# Altium schematic sheet Power Regulators.SchDoc
size A4; SheetNumber: 1; SheetTotal: 4
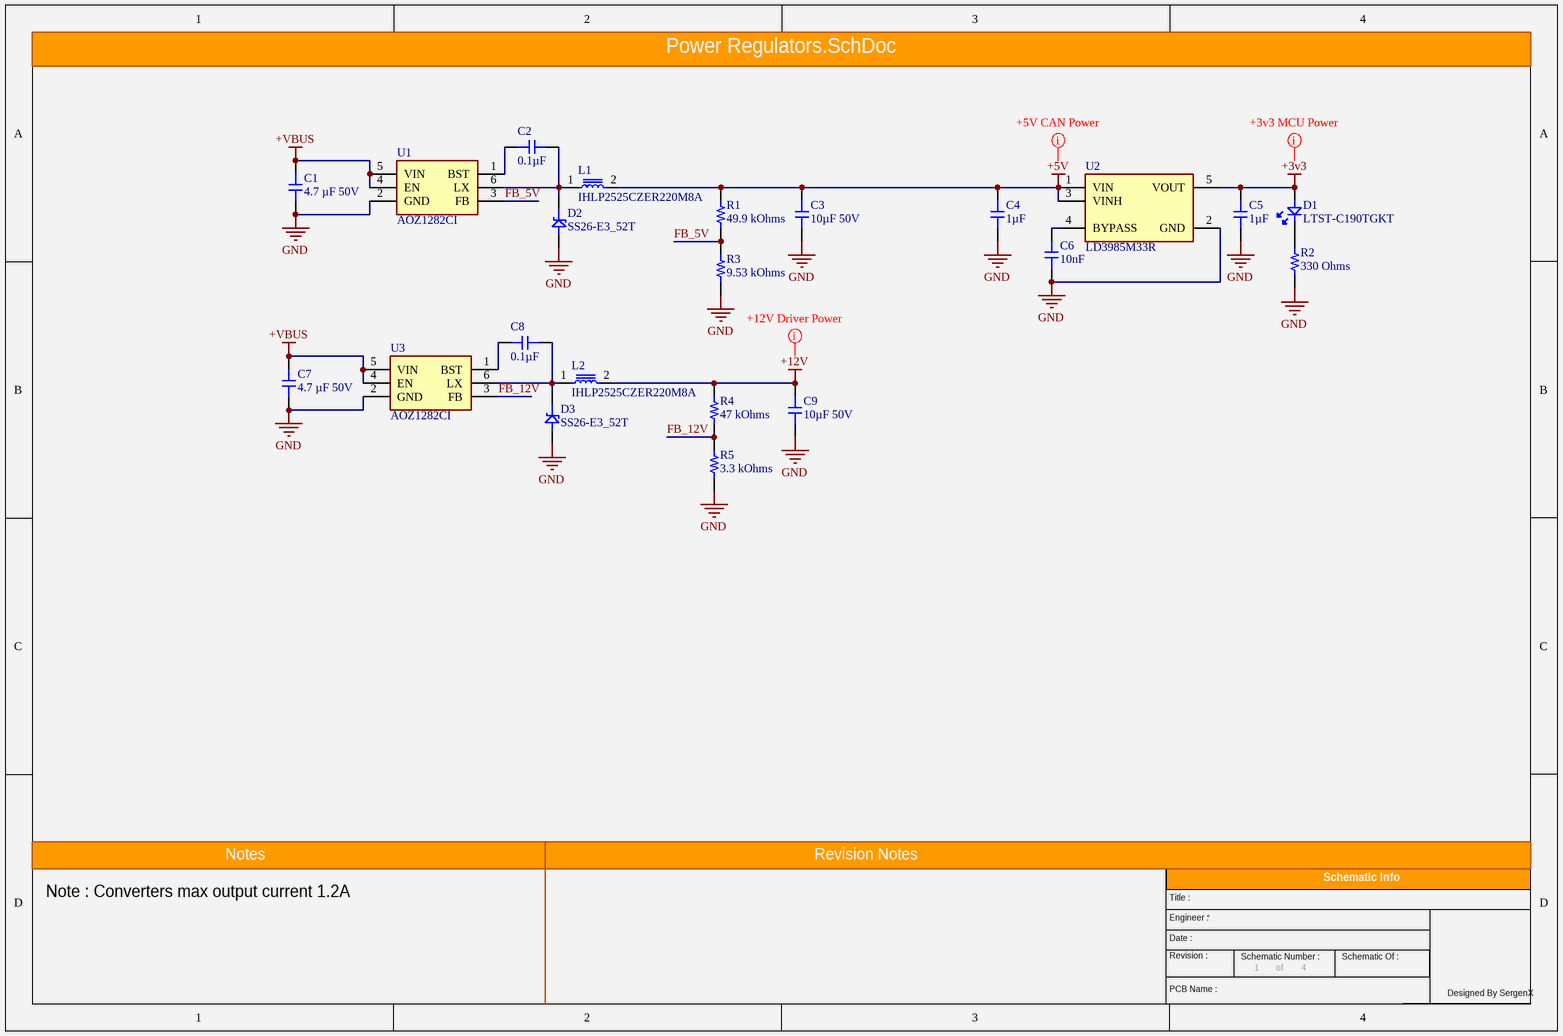
[diagram p0: Power Regulators.SchDoc]

## Parts
C1  4.7 µF 50V  [1206_10uF]
C2  0.1µF  [0805]
C3  10µF 50V  [1206_10uF]
C4  1µF  [0603_Footprint]
C5  1µF  [0603_Footprint]
C6  10nF  [0603_Footprint]
C7  4.7 µF 50V  [1206_10uF]
C8  0.1µF  [0805]
C9  10µF 50V  [1206_10uF]
D1  LTST-C190TGKT  [LEDC1608X80N]
D2  SS26-E3_52T  [DIOM5436X244N]
D3  SS26-E3_52T  [DIOM5436X244N]
L1  IHLP2525CZER220M8A  [INDPM6965X300N]
L2  IHLP2525CZER220M8A  [INDPM6965X300N]
R1  49.9 kOhms  [0603_RES]
R2  330 Ohms  [0603_RES]
R3  9.53 kOhms  [0603_RES]
R4  47 kOhms  [0603_RES]
R5  3.3 kOhms  [0603_RES]
U1  AOZ1282CI  [SOT95P280X125-6N]
U2  LD3985M33R  [SOT95P280X145-5N]
U3  AOZ1282CI  [SOT95P280X125-6N]

## Nets
+3v3: C5.1 D1.2(A) U2.5(VOUT)
+5V: C3.1 C4.1 L1.2 R1.2 U2.1(VIN) U2.3(VINH)
+12V: C9.1 L2.2 R4.2
+VBUS: C1.1 C7.1 U1.4(EN) U1.5(VIN) U3.4(EN) U3.5(VIN)
GND: C1.2 C3.2 C4.2 C5.2 C6.2 C7.2 C9.2 D2.2(A) D3.2(A) R2.1 R3.1 R5.1 U1.2(GND) U2.2(GND) U3.2(GND)
FB_5V: R1.1 R3.2 U1.3(FB)
FB_12V: R4.1 R5.2 U3.3(FB)
NetC2_1: C2.1 U1.1(BST)
NetC2_2: C2.2 D2.1(K) L1.1 U1.6(LX)
NetC6_1: C6.1 U2.4(BYPASS)
NetC8_1: C8.1 U3.1(BST)
NetC8_2: C8.2 D3.1(K) L2.1 U3.6(LX)
NetD1_1: D1.1(K) R2.2

## Layout directives
mark named +12V Driver Power: (no net found under the mark)
mark named +5V CAN Power: (no net found under the mark)
mark named +3v3 MCU Power: (no net found under the mark)

## Notes on the sheet
- Note : Converters max output current 1.2A
- Notes
- Revision Notes
- Title :
- Engineer :
- Schematic Info
- Date :
- Revision :
- PCB Name :
- Schematic Number :
- of
- Schematic Of :
- Designed By SergenX

## Library data of the parts
C1 C7 = 4.7 uF 50V 1206: 10 uF 50V 1206
C2 C8 = 0.1uF 0805 Surface Capacitor
C3 C9 = 10 uF 50V 1206
C4 C5 = 1uF 0603 Surface Capacitor
C6 = 10nF 0603 Surface Capacitor
D1 = LTST-C190TGKT: 20mA Generic 0603 Led SMD; Manufacturer_Name: Lite-On; Manufacturer_Part_Number: LTST-C190KRKT; Datasheet Link: https://componentsearchengine.com/Datasheets/1/LTST-C190KRKT.pdf; Height: 0.8mm; Mouser Part Number: 859-LTST-C190KRKT; Mouser Price/Stock: https://www.mouser.co.uk/ProductDetail/Lite-On/LTST-C190KRKT?qs=kAD5fFa1n5VY3YYNWPC1Fg%3D%3D; Arrow Part Number: LTST-C190KRKT; Arrow Price/Stock: https://www.arrow.com/en/products/ltst-c190krkt/lite-on-technology?region=europe
D2 D3 = SS26-E3_52T: 2A SMD Schottky Diode; Manufacturer_Name: Vishay; Manufacturer_Part_Number: SS26-E3/52T; Datasheet Link: https://componentsearchengine.com/Datasheets/2/SS26-E3_52T.pdf; Height: 2.44mm; Mouser Part Number: 625-SS26-E3; Mouser Price/Stock: https://www.mouser.co.uk/ProductDetail/Vishay-General-Semiconductor/SS26-E3-52T?qs=x2jpVgRnAtNToatHaCRUvw%3D%3D; Arrow Part Number: SS26-E3/52T; Arrow Price/Stock: https://www.arrow.com/en/products/ss26-e352t/vishay?region=europe
L1 L2 = IHLP2525CZER220M8A: Fixed Inductor 22uH 2.8A 174 mOHM SMD; Manufacturer_Name: Vishay; Datasheet Link: https://componentsearchengine.com/Datasheets/2/IHLP2525CZER220M8A.pdf; Height: 3mm; Manufacturer_Part_Number: IHLP2525CZER220M8A; Mouser Part Number: 70-IHLP2525CZR220M8A; Mouser Price/Stock: https://www.mouser.co.uk/ProductDetail/Vishay-Dale/IHLP2525CZER220M8A?qs=ei%2FvZTf36ZyKyW60gc1ORQ%3D%3D; Arrow Part Number: IHLP2525CZER220M8A; Arrow Price/Stock: https://www.arrow.com/en/products/ihlp2525czer220m8a/vishay
R1 = 49.9 kOhms 0603
R2 = 330 Ohm 0603
R3 = 9.53 kOhms 0603
R4 = 47 kOhms 0603: 47 kOhm 0603
R5 = 3.3 kOhms 0603
U1 U3 = AOZ1282CI: +36V 1.2A Buck Converter; Manufacturer_Name: Alpha & Omega Semiconductors; Datasheet Link: http://www.aosmd.com/res/data_sheets/AOZ1282CI.pdf; Height: 1.25mm; Manufacturer_Part_Number: AOZ1282CI; Arrow Part Number: AOZ1282CI; Arrow Price/Stock: https://www.arrow.com/en/products/aoz1282ci/alpha-and-omega-semiconductor?region=nac
U2 = LD3985M33R: IC REG LIN 3.3V 150MA TSOT23-5; Package: None; Availability: Unavailable; Value: *; MP: LD3985M33R; Price: None